# EAGLE design ble_blind_mover (EAGLE 9.6.2)
Assembly variants: USB_FALLBACK, 230V

## Sheet 1 of 4: Cover page
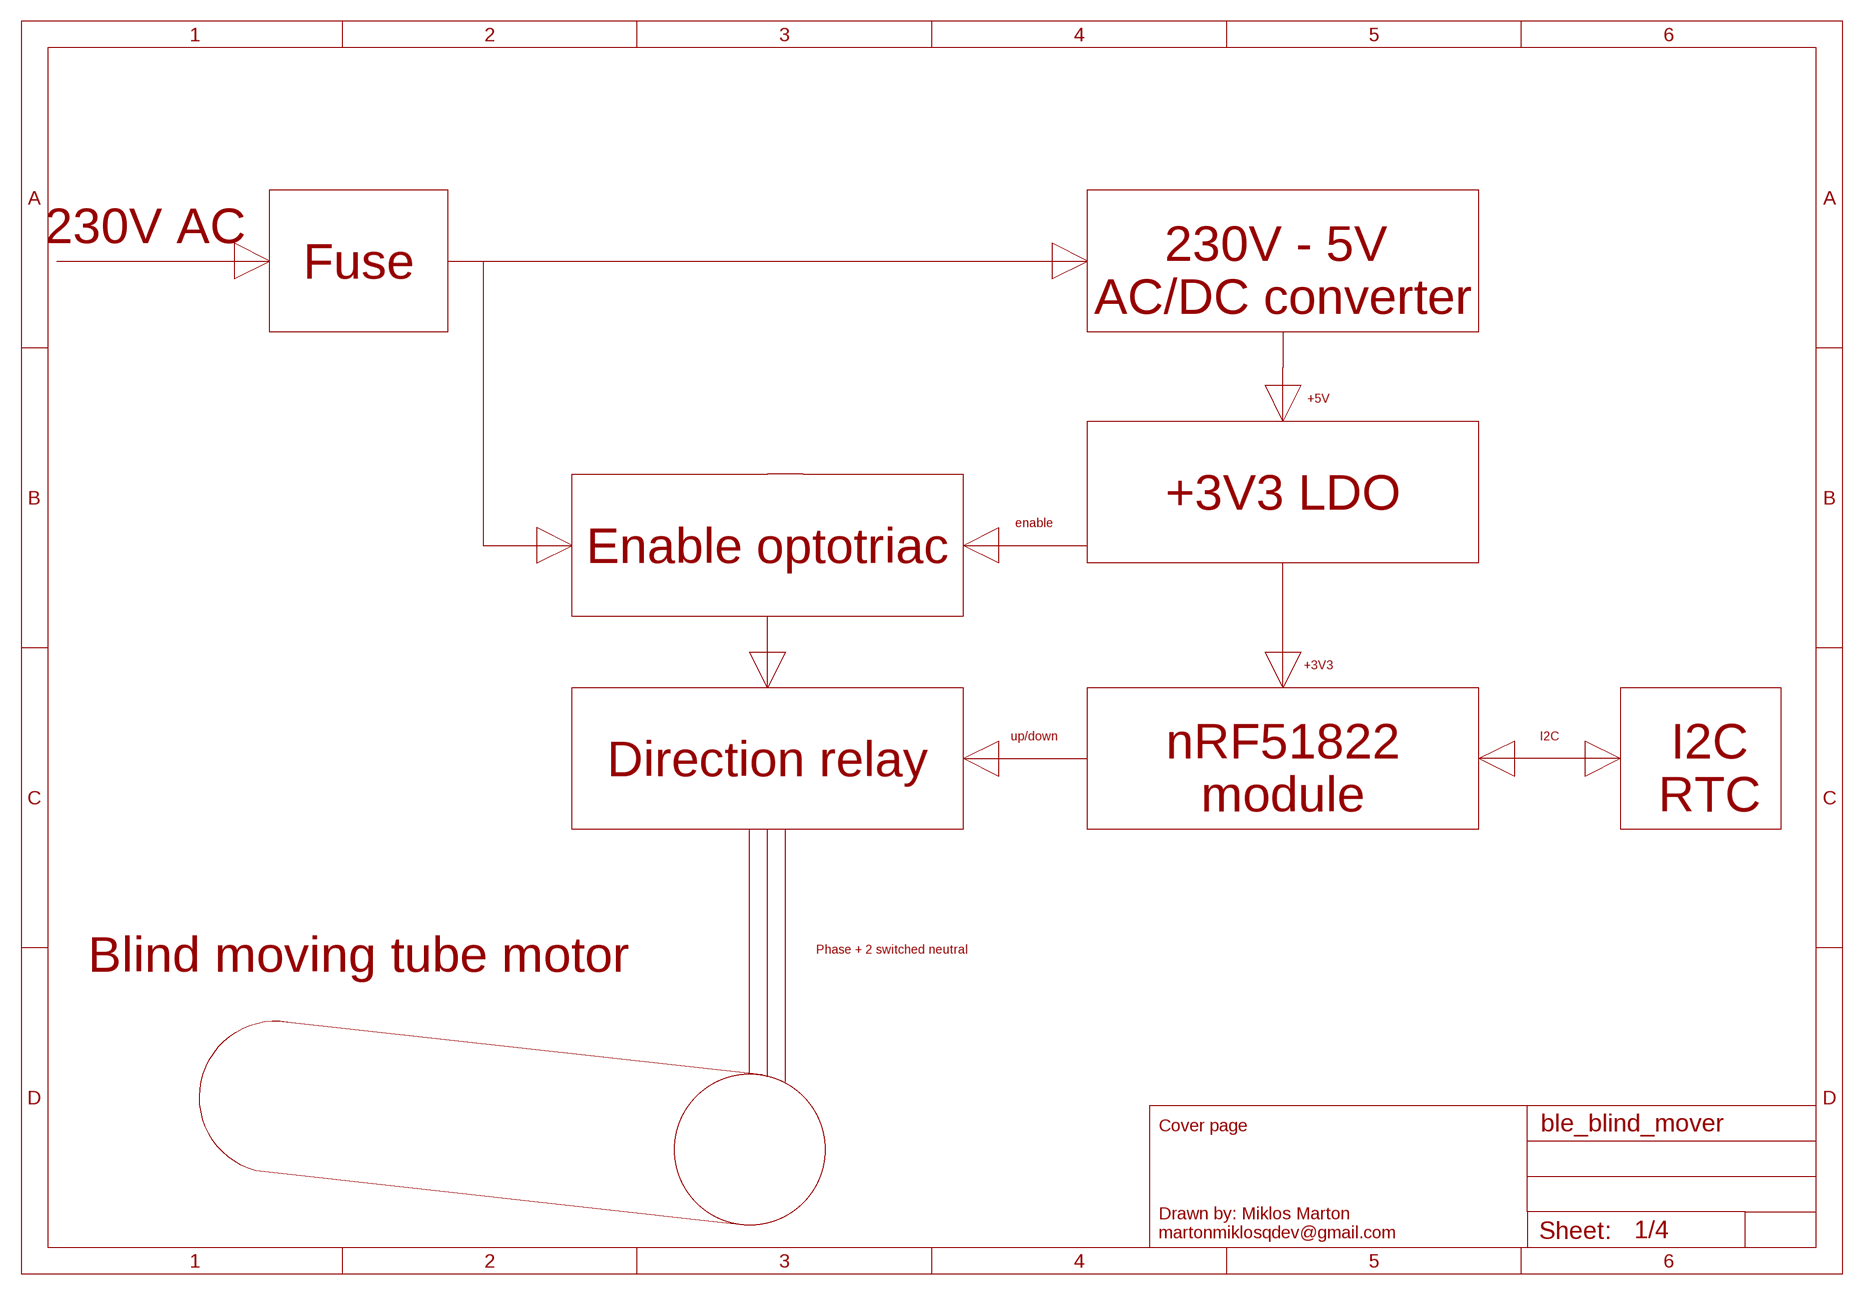
[diagram p0: schematic, sheet 1]

### Notes on the sheet
- 230V AC
- Fuse
- 230V - 5V 
  AC/DC converter
- +5V
- +3V3 LDO
- enable
- Enable optotriac
- +3V3
- up/down | I2C
- Direction relay
- nRF51822
  module
- I2C
  RTC
- Phase + 2 switched neutral
- Blind moving tube motor

## Sheet 2 of 4: High voltage parts (relays+ACDC converter)
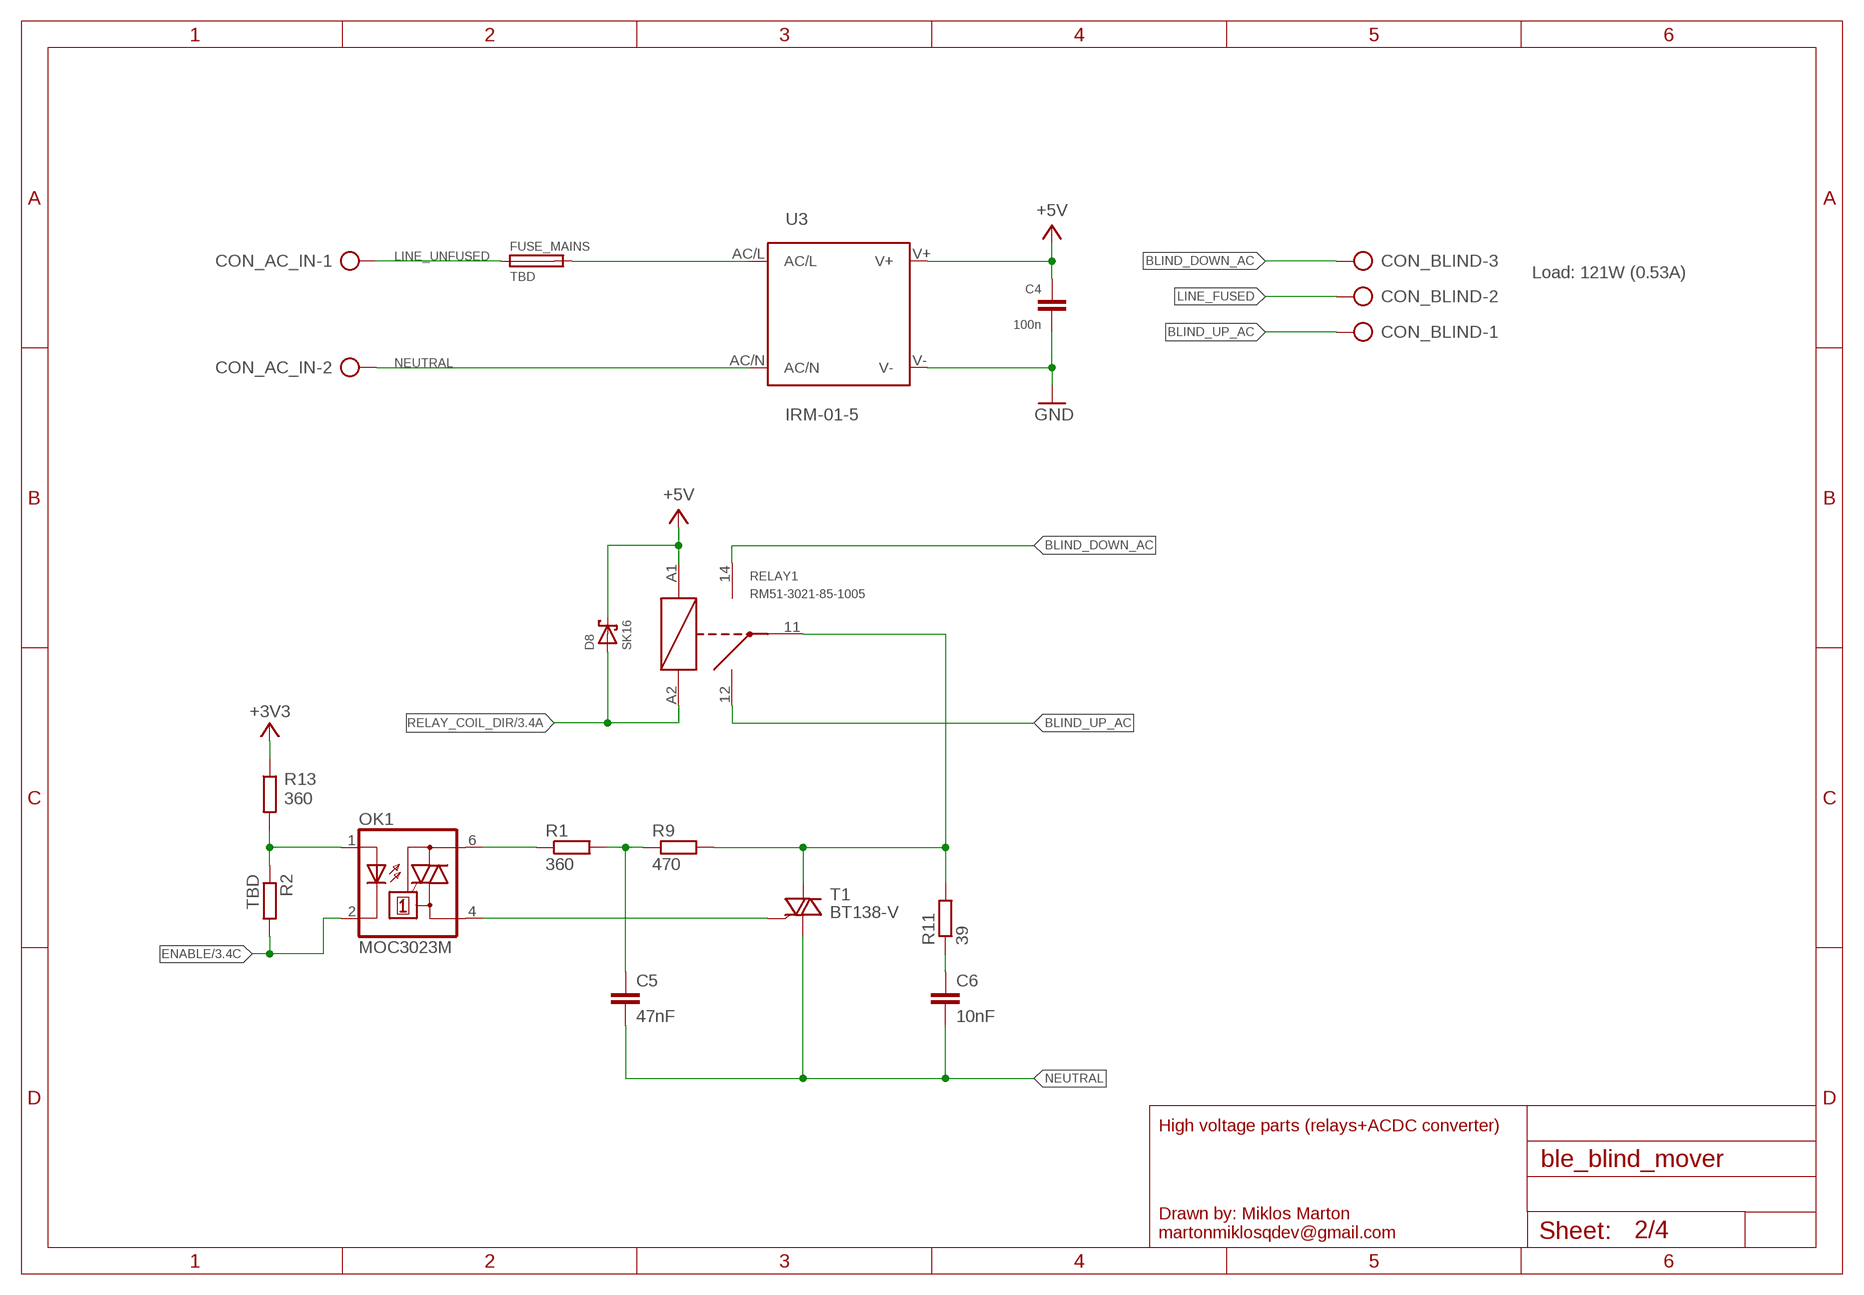
[diagram p1: schematic, sheet 2]

### Parts
C4  100n  C-EUC0603  [C0603]
C5  47nF  C-EU025-030X050  [C025-030X050]
C6  10nF  C-EU025-030X050  [C025-030X050]
CON_AC_IN  AK500/2  [AK500/2]
CON_BLIND  AK500/3  [AK500/3]
D8  SK16  SCHOTTKY-DIODESK12  [DO-214AC]
FUSE_MAINS  TBD  SH22,5  [SH22,5]
OK1  MOC3023M  [DIL06]
R1  360  R-EU_R0805  [R0805]
R2  TBD  R-EU_R0603  [R0603]
R9  470  R-EU_R0805  [R0805]
R11  39  R-EU_0204/2V  [0204V]
R13  360  R-EU_R0603  [R0603]
RELAY1  RM51-3021-85-1005  RM50-3011-XX-XXXX  [RM50-3011-XX-XXXX]
T1  BT138-V  [TO220BV]
U3  IRM-01-5  IRM_01/02IRM_01/02  [IRM_01/02]

### Nets
+3V3 [low_voltage]: R13.1 ; also sheet 3,4
+5V [low_voltage]: C4.1 D8.C RELAY1.A1 U3.V+ ; also sheet 3
BLIND_DOWN_AC [neutral]: CON_BLIND.3 RELAY1.14
BLIND_UP_AC [neutral]: CON_BLIND.1 RELAY1.12
ENABLE [low_voltage]: OK1.2(C) R2.2 ; also sheet 3
GND [low_voltage]: C4.2 U3.V- ; also sheet 3,4
LINE_FUSED [high_voltage]: CON_BLIND.2 FUSE_MAINS.2 U3.AC/L
LINE_UNFUSED [high_voltage]: CON_AC_IN.1 FUSE_MAINS.1
LOAD_B: R9.2 R11.2 RELAY1.11 T1.T2(A2)
MOC_AN: OK1.1(A) R2.1 R13.2
MOC_OUT: OK1.6(A2) R1.1
N$2: C5.1 R1.2 R9.1
NEUTRAL [high_voltage]: C5.2 C6.2 CON_AC_IN.2 T1.T1(A1) U3.AC/N
RELAY_COIL_DIR [low_voltage]: D8.A RELAY1.A2 ; also sheet 3
SNUB_MID: C6.1 R11.1
TRIAC_GET: OK1.4(A1) T1.G

### Notes on the sheet
- Load: 121W (0.53A)

## Sheet 3 of 4: BLE MCU
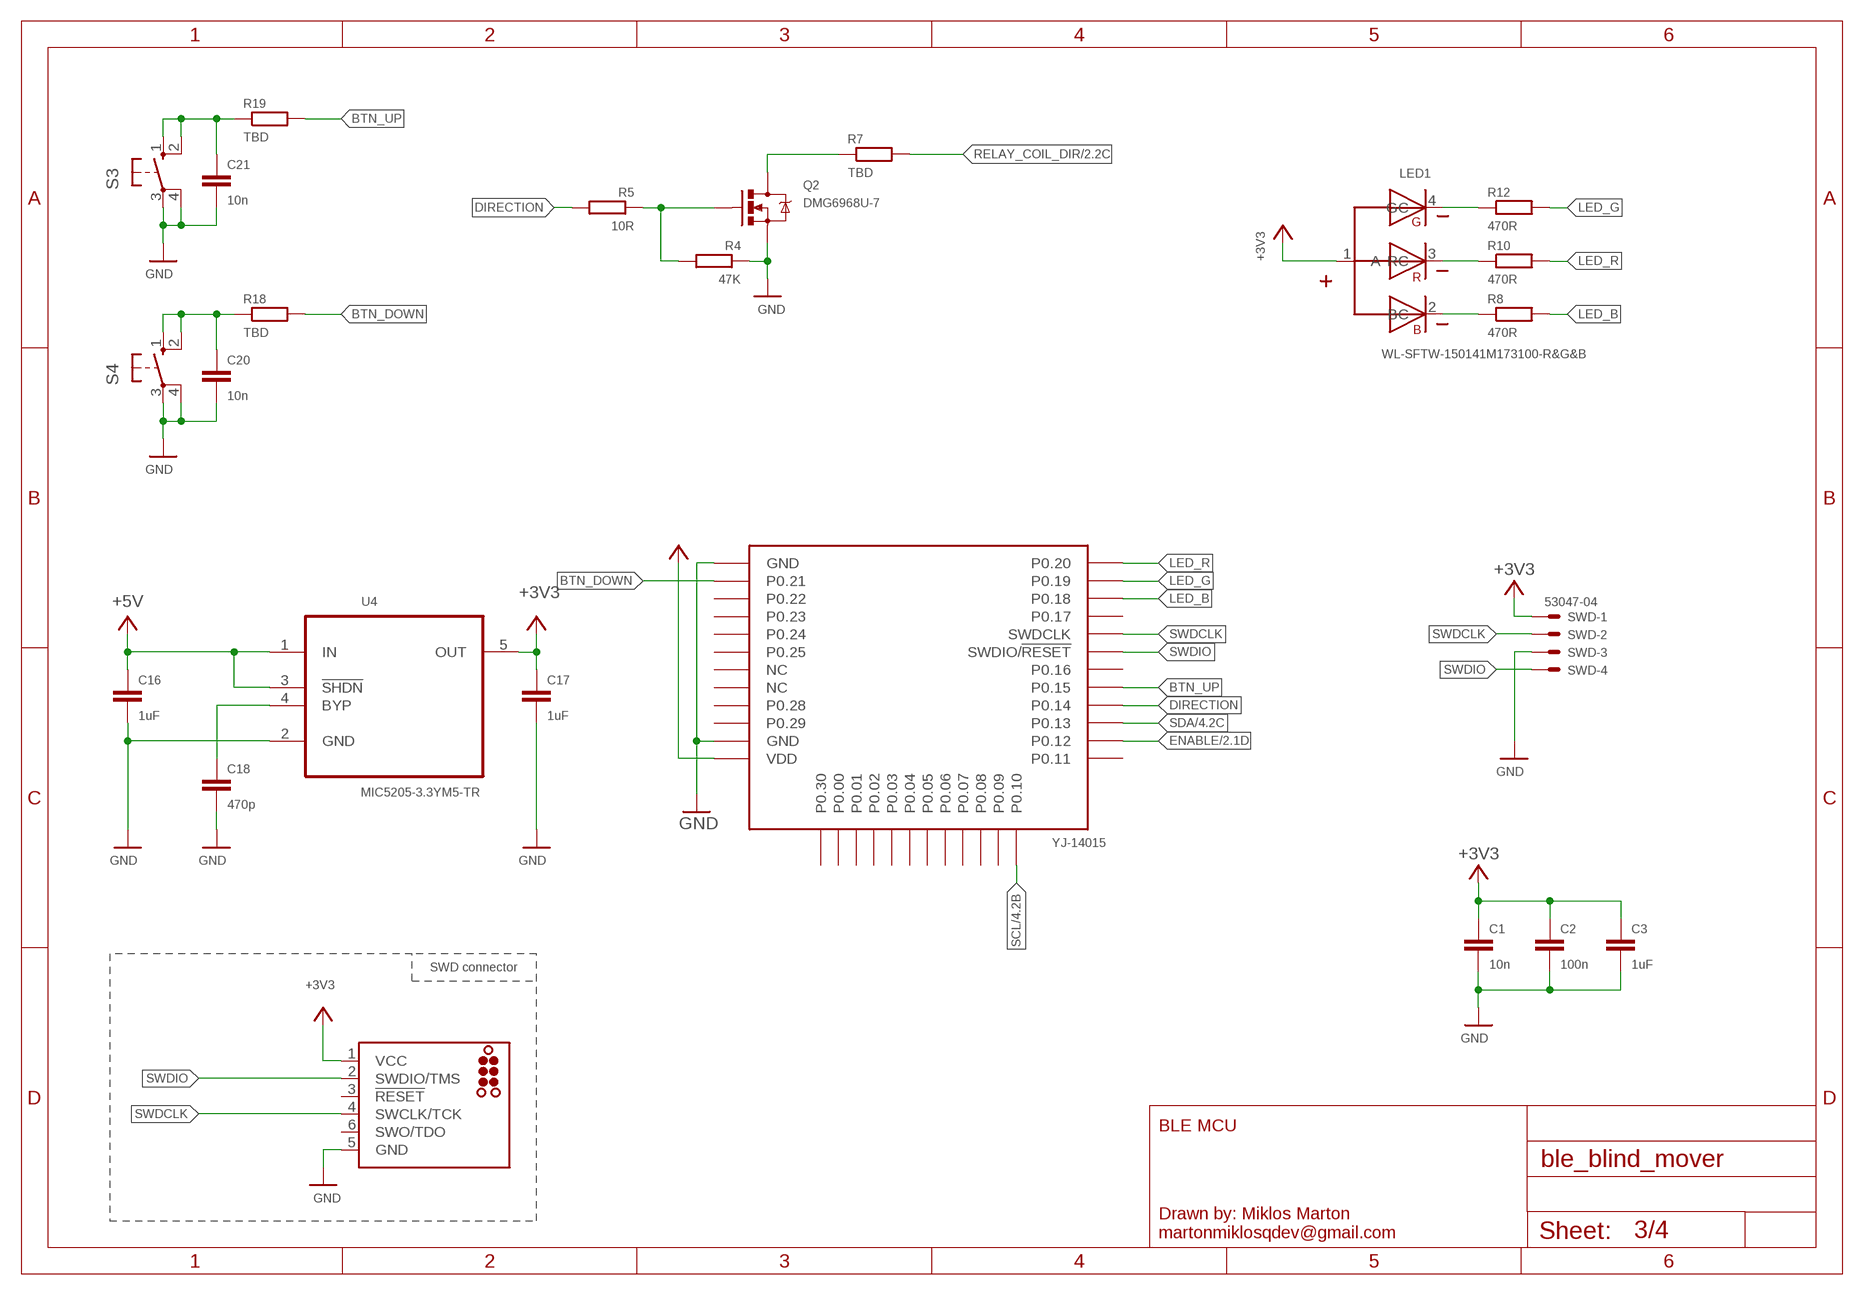
[diagram p2: schematic, sheet 3]

### Parts
C1  10n  C-EUC0603  [C0603]
C2  100n  C-EUC0603  [C0603]
C3  1uF  C-EUC0603  [C0603]
C16  1uF  C-EUC0603  [C0603]
C17  1uF  C-EUC0603  [C0603]
C18  470p  C-EUC0603  [C0603]
C20  10n  C-EUC0603  [C0603]
C21  10n  C-EUC0603  [C0603]
J2  TC2030_SWD-MCP-NL  [TC2030-MCP-NL]
LED1  WL-SFTW-150141M173100-R&G&B  [3528-COMMON-ANODE]
Q2  DMG6968U-7  MOSFET-NCHANNELSMD  [SOT23-3]
R4  47K  R-EU_R0603  [R0603]
R5  10R  R-EU_R0603  [R0603]
R7  TBD  R-EU_R0603  [R0603]
R8  470R  R-EU_R0603  [R0603]
R10  470R  R-EU_R0603  [R0603]
R12  470R  R-EU_R0603  [R0603]
R18  TBD  R-EU_R0603  [R0603]
R19  TBD  R-EU_R0603  [R0603]
S3  10-XX  [B3F-10XX]
S4  10-XX  [B3F-10XX]
SWD  53047-04  [53047-04]
U2  YJ-14015  [YJ-14015]
U4  MIC5205-3.3YM5-TR  LT1761ES5-3.3TRMPBF  [SOT95P280X145-5N]

### Nets
+3V3 [low_voltage]: C1.1 C2.1 C3.1 C17.1 J2.1(VCC) LED1.1(A) SWD.1 U2.VDD U4.5(OUT) ; also sheet 2,4
+5V [low_voltage]: C16.1 U4.1(IN) U4.3(!SHDN) ; also sheet 2
BTN_DOWN [low_voltage]: R18.2 U2.P.21(P0.21)
BTN_DOWN_R [low_voltage]: C20.1 R18.1 S4.1(S) S4.2(S1)
BTN_UP [low_voltage]: R19.2 U2.P.15(P0.15)
BTN_UP_R [low_voltage]: C21.1 R19.1 S3.1(S) S3.2(S1)
DIRECTION [low_voltage]: R5.2 U2.P.14(P0.14)
ENABLE [low_voltage]: U2.P.12(P0.12) ; also sheet 2
GND [low_voltage]: C1.2 C2.2 C3.2 C16.2 C17.2 C18.2 C20.2 C21.2 J2.5(GND) Q2.2(S) R4.1 S3.3(P) S3.4(P1) S4.3(P) S4.4(P1) SWD.3 U2.GND U2.GND@2(GND) U4.2(GND) ; also sheet 2,4
LED2_B_R [low_voltage]: LED1.2(BC) R8.1
LED2_G_R [low_voltage]: LED1.4(GC) R12.1
LED2_R_R [low_voltage]: LED1.3(RC) R10.1
LED_B [low_voltage]: R8.2 U2.P.18(P0.18)
LED_G [low_voltage]: R12.2 U2.P.19(P0.19)
LED_R [low_voltage]: R10.2 U2.P.20(P0.20)
MOTOR_B_GATE_R [low_voltage]: Q2.1(G) R4.2 R5.1
RELAY_COIL_DIR [low_voltage]: R7.2 ; also sheet 2
RELAY_COIL_DIR_R [low_voltage]: Q2.3(D) R7.1
SCL: U2.P.10(P0.10) ; also sheet 4
SDA [low_voltage]: U2.P.13(P0.13) ; also sheet 4
SWDCLK [low_voltage]: J2.4(SWCLK/TCK) SWD.2 U2.SWDCLK
SWDIO [low_voltage]: J2.2(SWDIO/TMS) SWD.4 U2.SWDIO(SWDIO/!RESET)
U4_BYPASS [low_voltage]: C18.1 U4.4(BYP)
Unconnected: J2.3(!RESET) J2.6(SWO/TDO) U2.P.00(P0.00) U2.P.01(P0.01) U2.P.02(P0.02) U2.P.03(P0.03) U2.P.04(P0.04) U2.P.05(P0.05) U2.P.06(P0.06) U2.P.07(P0.07) U2.P.08(P0.08) U2.P.09(P0.09) U2.P.11(P0.11) U2.P.16(P0.16) U2.P.17(P0.17) U2.P.22(P0.22) U2.P.23(P0.23) U2.P.24(P0.24) U2.P.25(P0.25) U2.P.26(NC) U2.P.27(NC) U2.P.28(P0.28) U2.P.29(P0.29) U2.P.30(P0.30)

### Notes on the sheet
- SWD connector

## Sheet 4 of 4: I2C RTC
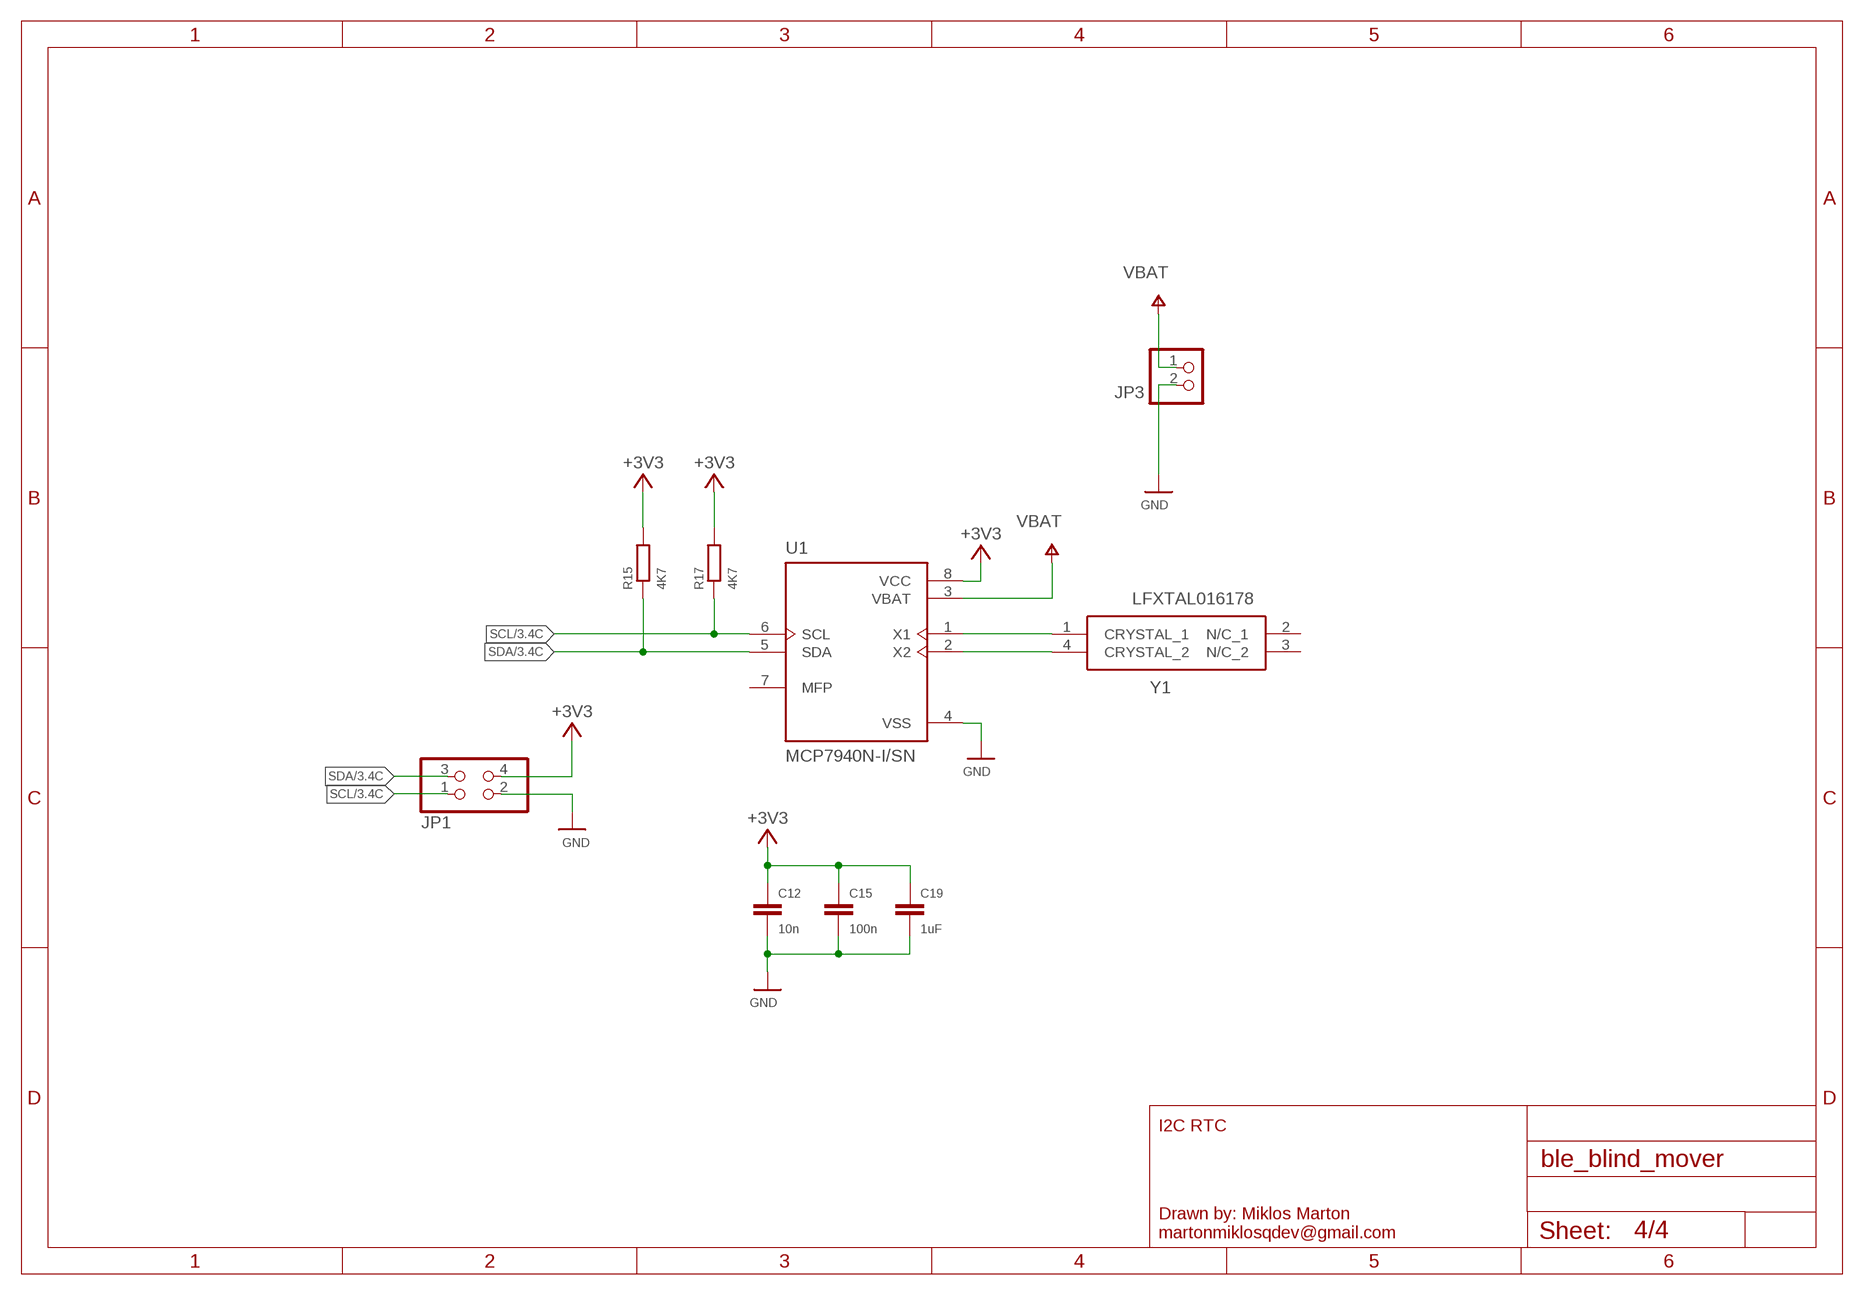
[diagram p3: schematic, sheet 4]

### Parts
C12  10n  C-EUC0603  [C0603]
C15  100n  C-EUC0603  [C0603]
C19  1uF  C-EUC0603  [C0603]
JP1  PINHD-2X2  [2X02]
JP3  PINHD-1X2  [1X02]
R15  4K7  R-EU_R0603  [R0603]
R17  4K7  R-EU_R0603  [R0603]
U1  MCP7940N-I/SN  [SOIC127P600X175-8N]
Y1  LFXTAL016178  [LFXTAL016178_1]

### Nets
+3V3 [low_voltage]: C12.1 C15.1 C19.1 JP1.4 R15.2 R17.2 U1.8(VCC) ; also sheet 2,3
GND [low_voltage]: C12.2 C15.2 C19.2 JP1.2 JP3.2 U1.4(VSS) ; also sheet 2,3
RTC_XTAL1: U1.1(X1) Y1.1(CRYSTAL_1)
RTC_XTAL2: U1.2(X2) Y1.4(CRYSTAL_2)
SCL: JP1.1 R17.1 U1.6(SCL) ; also sheet 3
SDA [low_voltage]: JP1.3 R15.1 U1.5(SDA) ; also sheet 3
VBAT: JP3.1 U1.3(VBAT)
Unconnected: U1.7(MFP) Y1.2(N/C_1) Y1.3(N/C_2)

## Library data of the parts
C1-C6 C12 C15-C21 = rcl:C-EU: CAPACITOR, European symbol
CON_AC_IN = con-ptr500:AK500/2: CONNECTOR; OC_FARNELL: unknown; OC_NEWARK: unknown
CON_BLIND = con-ptr500:AK500/3: CONNECTOR; OC_FARNELL: unknown; OC_NEWARK: unknown
D8 = diode:SCHOTTKY-DIODE: Schottky Diode; OC_RET: 95-01-34
FUSE_MAINS = fuse:SH22,5: FUSE HOLDER grid 22,5 mm, OGN0031 8201, Schurter (Buerklin); MF: SCHURTER; MPN: 0031.8201; OC_RET: 51-01-42
J2 = tag-connect:TC2030_SWD: ARM20-CTX 20-Pin to TC2030-IDC Adapter for Cortex 6-Pin (TC2030-IDC family) </catalog/6> Cortex SWD </catalog/9> Adapters </adaptors> <javascript:void(0);> The Tag-Connect ARM20-CTX adapter board allows our TC2030-IDC cables to be used for ARM SWD (Single Wire Debug) applications. Although intended for use with our patented TC2030-IDC (and TC2030-IDC-NL) Plug-of-Nails™ Cables, the adapter may be useful to people wishing to use 6-pin 0.1” ribbon headers on their PCB instead of the traditional 20-Pin header. Please note the TC2030-IDC <http://tag-connect.com/TC2030-IDC> or TC2030-IDC-NL <http://tag-connect.com/TC2030-IDC-NL> cable is purchased separately, the cables and Segger JLINK seen in the pictures are not included! Download the Datasheet here. <http://www.tag-connect.com/Materials/ARM20-CTX.pdf>
JP1 = pinhead:PINHD-2X2: PIN HEADER
JP3 = pinhead:PINHD-1X2: PIN HEADER
LED1 = Wurth_Elektronik_Optoelectronics_rev15b:WL-SFTW: SMD full-color TOP LED Characteristics Low energy consumption High reliability Low current requirement Fast switching No UV/IR radiation High brightness RGB individual control Compact package outline Black surface Applications Flash light Switch indicators Equipments indicators Accent and decorative lighting Electronic signage Video displays Backlight for LCDs, PDAs and TVs Oven, microwave Street lighting Ideal for lateral coupling in light guides <http://katalog.we-online.de/media/images/eipal/WL-SFTW_pf2.jpg> Details see: http://katalog.we-online.de/en/led/WL-SFTW?m Updated 2015-04-10 2015 (C) Wurth Elektronik
OK1 = optocoupler:MOC30*M: RANDOM-PHASE OPTOISOLATORS TRIAC DRIVER OUTPUT Source: http://www.fairchildsemi.com MOC3020-M.pdf; MF: FAIRCHILD SEMICONDUCTOR; MPN: MOC3023-M; OC_FARNELL: 1021367; OC_NEWARK: 72K8896
Q2 = SparkFun:MOSFET-NCHANNEL
R1 R2 R4 R5 R7 R9 R11 R13 R15 R17-R19 = rcl:R-EU_: RESISTOR, European symbol
R8 R10 R12 = rcl:R-EU_: RESISTOR, European symbol; OC_TME: SMD0603-470R
RELAY1 = relay-relpol:RM50-3011-XX-XXXX: RM50-3011-XX-XXXX (1CO) miniature relays from relpol S.A. <http://www.relpol.pl> (C) 2014 Tomasz Boleslaw CEDRO, cederom@tlen.pl, http://www.tomek.cedro.info. Version 0.1 (2014-01-12): Initial release.; OC_TME: RM513021851005
S3 S4 = switch-omron:10-XX: OMRON SWITCH; MPN: B3F-1000; OC_FARNELL: 176432; OC_NEWARK: 36M3542
SWD = con-molex:53?-04: CONNECTOR wire to board 1.25 mm (.049 inch) pitch header; MF: WALDOM/MOLEX; MPN: 53047-0410; OC_FARNELL: 9733060; OC_NEWARK: 38C9900
T1 = triac:BT138: TRIAC Source: http://www.semiconductors.philips.com BT138_SERIES_2.pdf
U1 = MCP7940N-I_SN:MCP7940N-I/SN: Real Time Clock (RTC) IC Clock/Calendar 64B I²C, 2-Wire Serial 8-SOIC (0.154", 3.90mm Width); AVAILABILITY: Unavailable; DESCRIPTION: Real Time Clock _RTC_ IC Clock/Calendar 64B I²C, 2-Wire Serial 8-SOIC _0.154, 3.90mm Width_; MF: Microchip; MP: MCP7940N-I/SN; OC_TME: MCP7940N-I/SN; PACKAGE: SO-8 Microchip; PRICE: None
U2 = YJ-14015:YJ-14015
U3 = meanwell_irm_v7:IRM_01/02: 1 or 2 watt housing & pin compatible IRM 01 Vout [V] Imax [A] Pmax [W] Eff [%] 3.3 0.3 1 66 5 0.2 1 70 9 0.111 1 72 12 0.083 1 74 15 0.067 1 75 24 0.042 1 77 IRM 2 Vout [V] Imax [A] Pmax [W] Eff [%] 3.3 0.6 2 66 5 0.4 2 70 9 0.222 2 72 12 0.167 2 74 15 0.133 2 75 24 0.087 2 77; OC_TME: IRM-01-5
U4 = LTC_By_element14_Batch_1:LT1761ES5-3.3TRMPBF: 100mA, Low Noise, LDO Micropower Regulators; MPN: LT1761ES5-3.3#TRMPBF; OC_FARNELL: 1663779; OC_NEWARK: 19P0920; OC_TME: MIC5205-3.3YM5-TR; PACKAGE: SOT-23-5; SUPPLIER: Linear Technology
Y1 = LFXTAL016178:LFXTAL016178: IQD FREQUENCY PRODUCTS - LFXTAL016178 - CRYSTAL, 32.768KHZ, 6PF, SMD Source: Datasheet <http://www.iqdfrequencyproducts.com/products/pn/LFXTAL016178Bulk.pdf>; DESCRIPTION: IQD FREQUENCY PRODUCTS - LFXTAL016178 - CRYSTAL, 32.768KHZ, 6PF, SMD; HEIGHT: mm; MANUFACTURER_NAME: IQD; MANUFACTURER_PART_NUMBER: LFXTAL016178; OC_TME: 32.768K-85SMXR; RS_PART_NUMBER: 1484350; RS_PRICE-STOCK: https://uk.rs-online.com/web/p/products/1484350

## Net classes
1 power: drill 0.5 mm
4 low_voltage: clearance 3 mm to class 3
6 neutral: clearance 3 mm to class 5

## Board
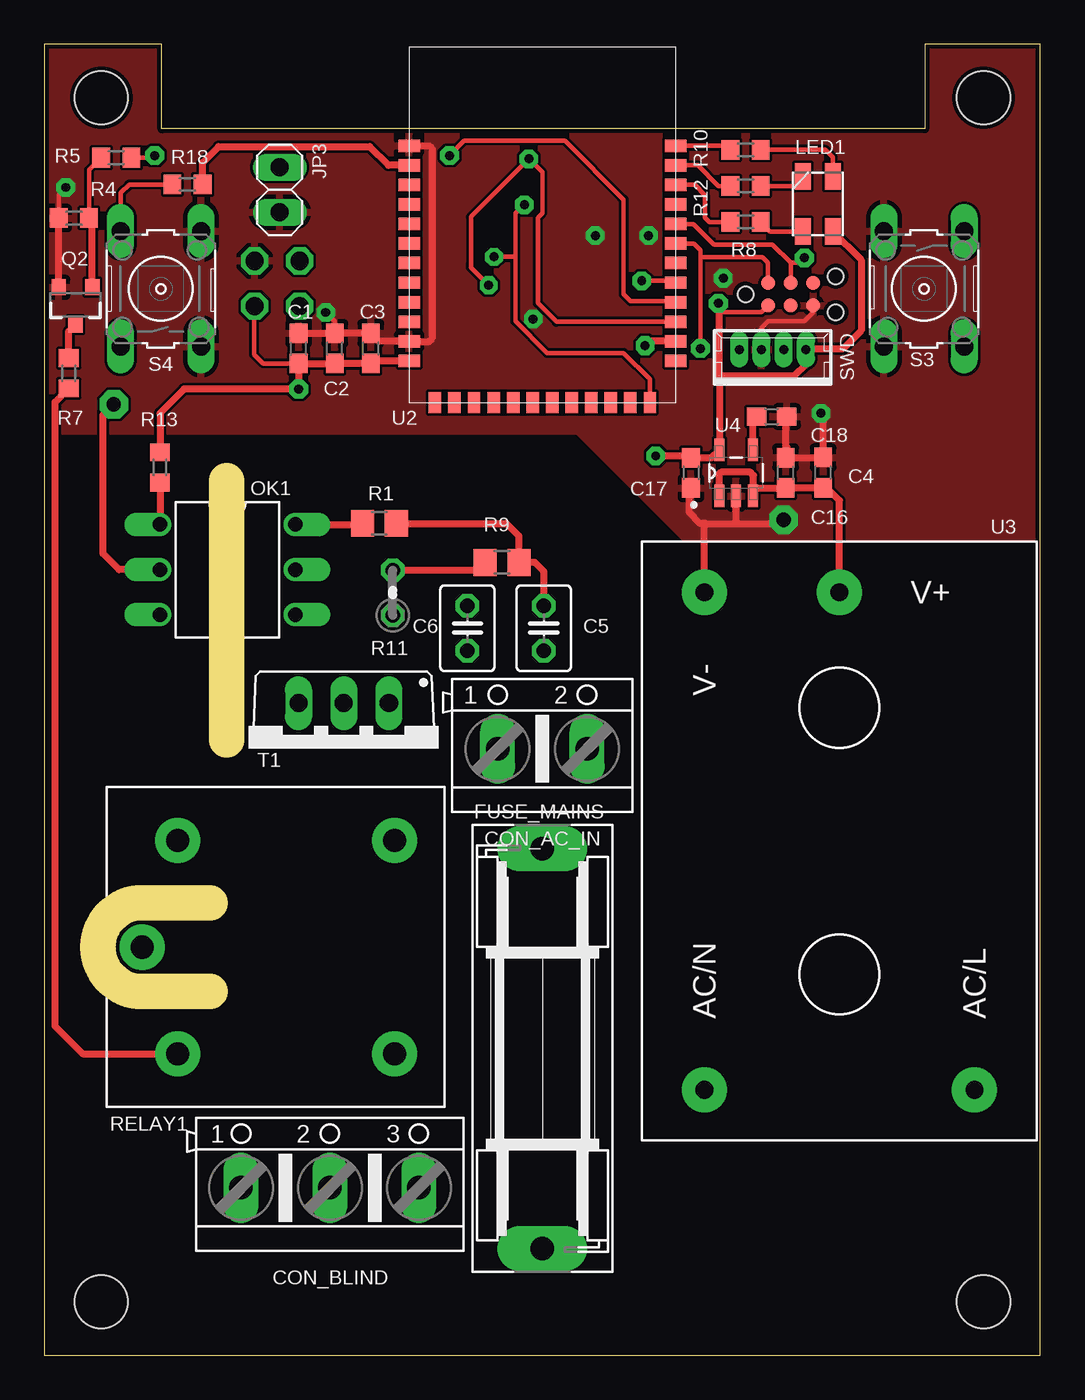
[diagram p4: board, top side]
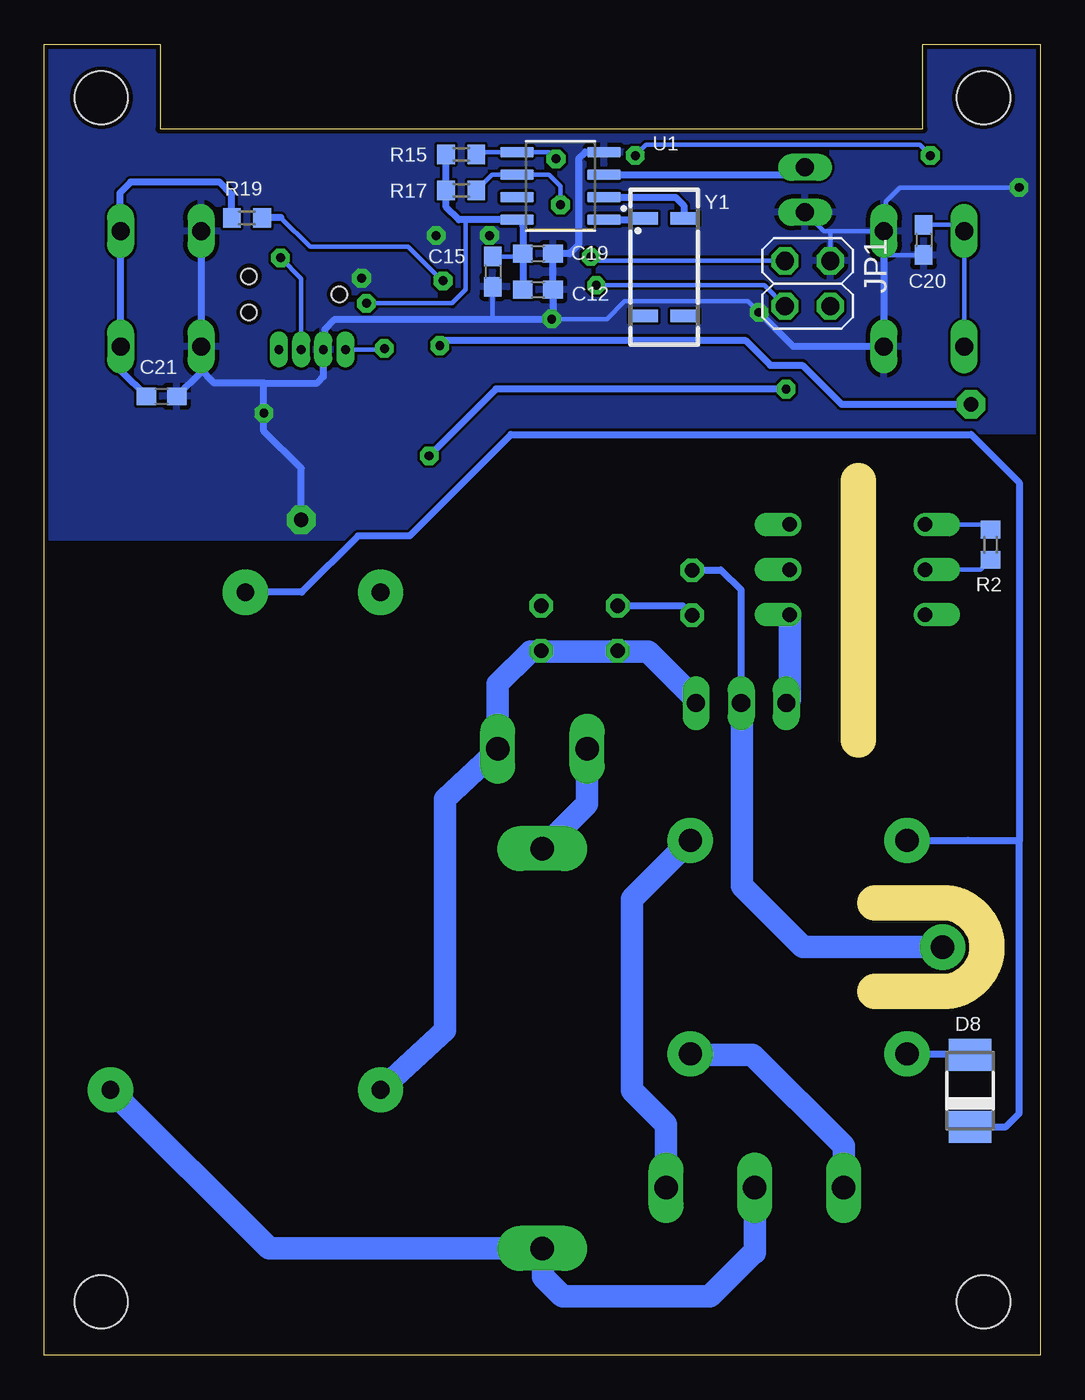
[diagram p5: board, bottom side, seen from below]

Size 56.05 x 73.75 mm. Coordinates in mm from the lower left corner, seen from the top.
Outline: 9.32,25.45 5.51,25.45 arc180 5.51,20.45 9.32,20.45
Outline: 10.25,34.61 10.25,49.22
Outline: 0,73.75 0,0 56.05,0 56.05,73.75 49.55,73.75 49.55,69 6.61,69 6.61,73.75 0,73.75
Copper layers (1*16): Top 0.035mm / dielectric 1.5mm / Bottom 0.035mm
Design rules "dirt_cheap_dirty_boards.v1": minimum track width 5mil, minimum drill 0.3mm, track to track 6mil, track to pad 6mil, pad to pad 6mil, via to via 6mil, smd to smd 0mil, copper to edge 10mil, drill to drill 10mil, minimum pad ring 10mil, minimum via ring 6mil, stop-mask expansion 2mil, vias tented up to drill 25mil, thermal gap 10mil
Holes 3 mm at 52.85,3 3.2,3 3.2,70.75 52.85,70.75

### Footprints (pad centres in the part's own frame; a part is rotated, then mirrored left to right if it is on the bottom)
C0603 = smd 1.1 x 1: 1 -0.85,0; 2 0.85,0
C025-030X050 = drill 0.813 octagon: 1 -1.27,0; 2 1.27,0
AK500/2 = drill 1.321 long: 1 -2.515,0; 2 2.515,0
AK500/3 = drill 1.321 long: 1 -5.004,0; 2 0,0; 3 5.004,0
DO-214AC = smd 1.8 x 2.4: A 2.025,0; C -2.025,0
SH22,5 = drill 1.321 pad 2.54 long: 1 -11.252,0; 2 11.252,0
TC2030-MCP-NL = smd 0.787 x 0.787: 1 1.27,-0.635; 2 1.27,0.635; 3 2.54,-0.635; 4 2.54,0.635; 5 3.81,-0.635; 6 3.81,0.635 | hole 0.889: 0,0; 5.08,-1.016; 5.08,1.016
2X02 = drill 1.016 octagon: 1 -1.27,-1.27; 2 -1.27,1.27; 3 1.27,-1.27; 4 1.27,1.27
1X02 = drill 1.016 long: 1 -1.27,0; 2 1.27,0
3528-COMMON-ANODE = smd 1.5 x 0.9: 1 1.55,0.85; 2 1.55,-0.85; 3 -1.55,0.85; 4 -1.55,-0.85
DIL06 = drill 0.813 offset: 1 -2.54,-3.81; 2 0,-3.81; 3 2.54,-3.81; 4 2.54,3.81; 5 0,3.81; 6 -2.54,3.81
SOT23-3 = smd 0.8 x 0.9: 1 -0.95,-1; 2 0.95,-1; 3 0,1.1
R0805 = smd 1.3 x 1.5: 1 -0.95,0; 2 0.95,0
R0603 = smd 1 x 1.1: 1 -0.85,0; 2 0.85,0
0204V = drill 0.813 octagon: 1 -1.27,0; 2 1.27,0
RM50-3011-XX-XXXX = drill 1.3 pad 2.54: 11 0,0; 12 14.2,-6; 14 14.2,6; A1 2,6; A2 2,-6
B3F-10XX = drill 1.016 long: 1 -3.251,2.261; 2 3.251,2.261; 3 -3.251,-2.261; 4 3.251,-2.261
53047-04 = drill 0.5 pad 0.698 long: 1 1.875,0.45; 2 0.625,0.45; 3 -0.625,0.45; 4 -1.875,0.45
TO220BV = drill 1.016 long: G 2.54,-2.54; T1 -2.54,-2.54; T2 0,-2.54
SOIC127P600X175-8N = smd 1.9 x 0.6: 1 -2.455,1.905; 2 -2.455,0.635; 3 -2.455,-0.635; 4 -2.455,-1.905; 5 2.455,-1.905; 6 2.455,-0.635; 7 2.455,0.635; 8 2.455,1.905
YJ-14015 = smd 1.2 x 0.7: GND -7.5,3.45; GND@2 -7.5,14.45; P.11 7.5,2.35; P.12 7.5,3.45; P.13 7.5,4.55; P.14 7.5,5.65; P.15 7.5,6.75; P.16 7.5,7.85; P.17 7.5,11.15; P.18 7.5,12.25; P.19 7.5,13.35; P.20 7.5,14.45; P.21 -7.5,13.35; P.22 -7.5,12.25; P.23 -7.5,11.15; P.24 -7.5,10.05; P.25 -7.5,8.95; P.26 -7.5,7.85; P.27 -7.5,6.75; P.28 -7.5,5.65; P.29 -7.5,4.55; SWDCLK 7.5,10.05; SWDIO 7.5,8.95; VDD -7.5,2.35 | smd 0.7 x 1.2: P.00 -4.95,0; P.01 -3.85,0; P.02 -2.75,0; P.03 -1.65,0; P.04 -0.55,0; P.05 0.55,0; P.06 1.65,0; P.07 2.75,0; P.08 3.85,0; P.09 4.95,0; P.10 6.05,0; P.30 -6.05,0
IRM_01/02 = drill 1 pad 2.54: AC/L -14,-7.6; AC/N -14,7.6; V+ 14,0; V- 14,7.6
SOT95P280X145-5N = smd 1.27 x 0.559: 1 -1.295,0.94; 2 -1.295,0; 3 -1.295,-0.94; 4 1.295,-0.94; 5 1.295,0.94
LFXTAL016178_1 = smd 0.7 x 1.6: 1 -2.75,-1.15; 2 2.75,-1.15; 3 2.75,1.15; 4 -2.75,1.15

### Placement (x,y rotation side)
C1  14.31,56.64 90 top
C2  16.34,56.64 90 top
C3  18.37,56.64 90 top
C4  43.83,49.66 90 top
C5  28.1,40.9 270 top
C6  23.8,40.9 270 top
C12  28.28,59.94 0 bottom
C15  30.82,60.96 270 bottom
C16  41.72,49.64 90 top
C17  36.38,49.64 270 top
C18  40.92,52.81 0 top
C19  28.28,61.98 0 bottom
C20  6.57,62.75 270 bottom
C21  49.45,53.95 0 bottom
CON_AC_IN  28.02,34.11 0 top
CON_BLIND  16.07,9.41 0 top
D8  3.96,14.88 90 bottom
FUSE_MAINS  28.02,17.25 270 top
J2  39.45,59.69 0 top
JP1  13.1,60.3 270 bottom
JP3  13.24,65.57 270 top
LED1  43.52,64.77 270 top
OK1  10.3,44.2 270 top
Q2  1.75,59.08 180 top
R1  18.85,46.8 0 top
R2  2.8,45.6 270 bottom
R4  1.66,63.98 0 top
R5  4.04,67.38 0 top
R7  1.37,55.25 270 top
R8  39.45,63.75 180 top
R9  25.75,44.6 180 top
R10  39.45,67.82 180 top
R11  19.6,42.9 90 top
R12  39.45,65.79 180 top
R13  6.5,49.95 270 top
R15  32.6,67.56 180 bottom
R17  32.6,65.53 180 bottom
R18  8.05,65.87 0 top
R19  44.65,63.99 0 bottom
RELAY1  5.51,22.95 0 top
S3  49.5,60 270 top
S4  6.55,60 90 top
SWD  40.98,56.13 0 top
T1  16.84,34.14 180 top
U1  27.01,65.79 180 bottom
U2  28.02,53.59 0 top
U3  44.74,28.92 90 top
U4  38.92,49.64 90 top
Y1  21.17,61.21 270 bottom

### Tracks (layer width: path | path; a pad name or v marks a point on that pad's centre or on a via)
+3V3  (via drill 0.5 pad 1.05)
  Top 0.254: 18.52,55.94 C3.1 | SWD.1 42.91,56.64 | 37.93,55.88 37.93,58.67 | v37.93,59.18 37.93,58.67 | J2.1 40.34,58.67 37.93,58.67 | C1.1 12.31,55.79 11.8,56.3 11.8,59 JP1.4
  Top 0.406: 18.52,55.94 U2.VDD | C3.1 C2.1 C1.1 v14.31,54.36 7.86,54.36 6.5,53 R13.1 | LED1.1 45.96,61.63 45.96,57.66 44.95,56.64 42.91,56.64 42.9,56.63 42.9,55.8 42.22,55.12 38,55.12 37.98,55.1 | 37.98,55.1 U4.5 37.54,50.49 C17.1 36.1,50.77 35.93,50.6 v34.4,50.6 | 37.98,55.1 37.98,59.13 v37.93,59.18
  Bottom 0.254: U1.8 29.13,63.55 | C15.1 29.3,61.81 C19.1 | 32.34,63.88 32.34,59.94 33.1,59.18 v37.93,59.18
  Bottom 0.406: R15.2 R17.2 33.45,64.6 32.72,63.88 32.34,63.88 U1.8 | C12.1 C19.1 29.13,63.55 | v14.31,54.36 30.64,54.36 v34.4,50.6
+5V
  Top 0.406: U4.1 37.98,49.58 38.1,49.7 39.7,49.7 39.9,49.5 39.9,48.7 | 39.9,48.7 39.9,48.38 U4.3 | 39.9,48.7 39.99,48.79 C16.1 44.04,48.79 | U3.V+ 44.74,48.09 44.04,48.79 | C4.1 44.02,48.81 44.04,48.79
  Bottom 0.406: D8.C 1.95,12.85 1.2,13.6 1.2,28.9 | RELAY1.A1 4.1,28.95 | 4.08,28.97 4.1,28.95 | 1.2,28.9 1.25,28.95 4.1,28.95 | U3.V+ 41.58,42.92 38.4,46.1 35.5,46.1 29.8,51.8 3.9,51.8 1.2,49.1 1.2,28.9
BLIND_DOWN_AC
  Bottom 1.27: CON_BLIND.3 21.07,12.97 23,14.9 23,25.66 RELAY1.14
BLIND_UP_AC
  Bottom 1.27: RELAY1.12 19.65,16.9 16.2,16.9 11.06,11.76 CON_BLIND.1
BTN_DOWN
  Top 0.406: U2.P.21 19.36,66.94 18.3,68 9.8,68 8.9,67.1 R18.2
BTN_DOWN_R
  Top 0.254: R18.1 4.77,65.87 4.3,65.4 4.3,63.26 S4.2
  Bottom 0.254: S4.1 S4.2 4.64,63.6 C20.1
BTN_UP  (via drill 0.5 pad 1.05)
  Top 0.254: v33.61,60.45 35.42,60.45 U2.P.15
  Bottom 0.254: 42.76,64.01 41.11,62.36 35.59,62.36 33.68,60.45 v33.61,60.45
  Bottom 0.406: 42.76,64.01 43.78,64.01 R19.2
BTN_UP_R
  Bottom 0.406: R19.1 45.5,65.3 46.2,66 51.2,66 51.8,65.4 51.8,63.29 | 51.8,63.29 S3.1 | C21.1 51.76,55.41 S3.2 S3.1 | S3.1 51.8,63.29
DIRECTION  (via drill 0.5 pad 1.05)
  Top 0.254: U2.P.14 35.47,59.3 32.98,59.3 32.6,59.69 32.6,65.02 29.3,68.33 23.63,68.33 v22.8,67.5 | R5.2 6.08,67.38 v6.2,67.5
  Bottom 0.254: v22.8,67.5 22.2,68.1 6.8,68.1 v6.2,67.5
ENABLE  (via drill 0.5 pad 1.05, 0.8 pad 1.6)
  Top 0.406: U2.P.12 34.04,57.04 v33.8,56.8 | OK1.2 4.2,44.2 3.3,45.1 3.3,52.9 v3.9,53.5
  Bottom 0.254: OK1.2 3.35,44.2 R2.2
  Bottom 0.406: v33.8,56.8 33.49,57.11 16.61,57.11 15.2,55.7 13.4,55.7 11.2,53.5 v3.9,53.5
GND  (via drill 0.5 pad 1.05, 0.8 pad 1.6)
  Top 0.254: U2.GND 20.15,57.04 | 16.09,57.49 C2.2 16.34,58.17 v15.83,58.67 | SWD.3 40.35,57.8 40.73,58.17 42.76,58.17 43.27,58.67 J2.5 | R4.1 0.81,65.31 v1.2,65.7
  Top 0.406: 20.15,57.04 18.82,57.04 C3.2 C2.2 | C1.2 16.09,57.49 | 36.32,48.23 C17.2 36.3,48.71 36.3,47.4 36.9,46.8 37.2,46.8 | 41.72,51 C16.2 43.81,50.49 C4.2 43.83,52.87 v43.7,53 | 41.72,51 41.72,52.75 C18.2 | 41.79,51.07 41.72,51 | 38.92,47.42 U4.2 38.92,46.98 38.9,46.8 | 38.9,46.8 41.4,46.8 v41.6,47 | 37.2,46.8 38.9,46.8 | 37.2,46.8 37.14,46.74 U3.V- | Q2.2 0.8,62.17 R4.1 | U2.GND@2 21.66,68.04 21.8,67.9 21.8,57.2 21.6,57 20.57,57 U2.GND
  Bottom 0.203: 27.43,60.2 C12.2
  Bottom 0.254: SWD.3 40.35,57.09 40.27,57.18 | C15.2 30.82,58.28 | 25.61,67.69 U1.4 | v1.2,65.7 7.9,65.7 8.7,64.9 8.7,63.36 S4.4 11.8,63.25 | 11.8,63.25 11.9,63.25 11.83,63.18 JP1.2 | C20.2 8.81,61.9 | v27.5,58.3 24.4,58.3 23.4,59.3 16.46,59.3 v15.83,58.67 | JP3.2 12.19,63.25 11.8,63.25
  Bottom 0.406: 40.27,57.18 40.27,57.72 39.71,58.28 30.82,58.28 27.43,58.28 C12.2 | 27.43,60.2 C19.2 26.5,61.98 25.99,62.48 25.99,67.31 25.61,67.69 | v41.6,47 41.6,49.9 43.7,52 v43.7,53 43.7,54.7 | SWD.3 40.35,55.05 40.7,54.7 43.7,54.7 | 43.7,54.7 46.5,54.7 47.3,55.5 47.3,56.69 S3.4 | 8.9,56.75 S4.3 | 8.9,56.75 13.91,56.75 v15.83,58.67 | S4.4 8.81,61.9 8.81,56.84 8.9,56.75 | S3.4 47.24,55.31 C21.2 | S3.3 S3.4
  other vias: 34,63 31,63 38.2,60.6
  pour Top: 0,73.75 0,52 30,52 36,46 56.05,46 56.05,73.75 49.55,73.75 49.55,69 6.61,69 6.61,73.75
  pour Bottom: 0,73.75 0,52 30,52 36,46 56.05,46 56.05,73.75 49.55,73.75 49.55,69 6.61,69 6.61,73.75
LED2_B_R
  Top 0.254: LED1.2 40.84,63.22 R8.1
LED2_G_R
  Top 0.254: LED1.4 42.67,65.81 42.64,65.79 R12.1
LED2_R_R
  Top 0.254: LED1.3 44.37,67.41 43.96,67.82 R10.1
LED_B
  Top 0.254: U2.P.18 36.6,65.84 37.17,65.28 37.17,64.01 37.42,63.75 R8.2
LED_G
  Top 0.254: U2.P.19 36.77,66.94 37.93,65.79 R12.2
LED_R
  Top 0.254: U2.P.20 38.38,68.04 R10.2
LINE_FUSED
  Bottom 1.27: CON_BLIND.2 16.07,5.76 16.14,5.76 18.6,3.3 26.9,3.3 28,4.4 28,5.97 FUSE_MAINS.2 43.41,5.99 U3.AC/L
LINE_UNFUSED
  Bottom 1.27: CON_AC_IN.1 25.51,31.01 FUSE_MAINS.1
LOAD_B
  Top 0.406: R11.2 24.37,44.17 R9.2
  Bottom 0.406: T1.T2 16.84,43.04 18,44.2 18.03,44.17 R11.2
  Bottom 1.27: RELAY1.11 13.35,22.95 16.8,26.4 16.8,32 16.8,36.64 T1.T2
MOC_AN
  Top 0.406: R13.2 OK1.1
  Bottom 0.254: OK1.1 3.09,46.74 R2.1
MOC_OUT
  Top 0.406: OK1.6 17.84,46.74 R1.1
MOTOR_B_GATE_R
  Top 0.254: R4.2 2.51,66.69 R5.1
  Top 0.406: Q2.1 2.7,63.78 R4.2
N$2
  Top 0.406: R1.2 26,46.8 26.7,46.1 R9.1 27.6,44.6 28.1,44.1 C5.1
NEUTRAL
  Bottom 0.406: C6.2 24.07,39.63 24.1,39.6 | C5.2 28.67,39.63 28.7,39.6
  Bottom 1.27: U3.AC/N 33.5,18.26 33.5,31.3 30.49,34.11 CON_AC_IN.2 30.54,37.76 28.7,39.6 24.1,39.6 22.1,39.6 19.38,36.88 T1.T1
RELAY_COIL_DIR
  Top 0.406: R7.2 0.6,53.63 0.6,18.5 2.15,16.95 RELAY1.A2
  Bottom 0.406: RELAY1.A2 4.01,16.95 D8.A
RELAY_COIL_DIR_R
  Top 0.406: R7.1 1.37,57.6 Q2.3
RTC_XTAL1
  Bottom 0.254: 22.4,63.88 Y1.1
  Bottom 0.406: U1.1 22.4,63.88
RTC_XTAL2
  Bottom 0.406: U1.2 20.53,65.15 20.07,64.69 20.07,64.01 | Y1.4 20.07,64.01 | 20.07,64.01 20.41,64.01
SCL  (via drill 0.5 pad 1, 0.5 pad 1.05)
  Top 0.254: 26.5,61.8 26.5,58.17 28.28,56.39 32.6,56.39 34.08,54.91 U2.P.10 | 26.5,61.8 26.5,64.26 27.01,64.77 | v25.3,61.8 26.5,61.8
  Top 0.406: 27.01,64.77 v27.01,64.73
  Bottom 0.254: R17.1 30.86,66.42 U1.6 27.64,66.42 27.01,65.79 v27.01,64.73 | JP1.1 25.07,61.57 v25.3,61.8
SDA  (via drill 0.5 pad 1, 0.5 pad 1.05)
  Top 0.254: U2.P.13 28.81,58.14 27.77,59.18 27.77,64.01 28.02,64.26 28.02,66.55 v27.26,67.31 24,64.05 24,61.4 24,61.2 v25,60.2
  Bottom 0.152: 31.62,67.69 R15.1
  Bottom 0.254: 31.62,67.69 U1.5 27.64,67.69 v27.26,67.31 | JP1.3 15.54,60.2 v25,60.2
SNUB_MID
  Bottom 0.406: C6.1 20.14,42.17 R11.1
SWDCLK  (via drill 0.5 pad 1.05)
  Top 0.254: U2.SWDCLK 36.52,63.64 37.68,62.48 40.98,62.48 41.99,61.47 | 41.99,61.47 J2.4 | v42.76,61.74 42.49,61.47 41.99,61.47
  Bottom 0.254: SWD.2 41.6,60.58 v42.76,61.74
SWDIO  (via drill 0.5 pad 1.05)
  Top 0.254: J2.2 40.73,61.47 40.41,61.78 37.3,61.78 37.1,61.78 | U2.SWDIO 36.54,62.54 36.91,62.17 36.91,61.8 | v36.91,56.64 36.91,61.5 | 36.91,61.5 36.91,61.72 | 36.91,61.72 36.91,61.77 36.91,61.78 37.1,61.78 | 36.91,61.8 36.91,61.67 | 37.1,61.78 36.98,61.78 36.91,61.72 | 36.91,61.5 36.91,61.8
  Bottom 0.254: v36.91,56.64 36.97,56.58 SWD.4
TRIAC_GET
  Bottom 1.27: OK1.4 14.11,36.87 T1.G
U4_BYPASS
  Top 0.406: U4.4 39.86,52.6 C18.1
VBAT
  Bottom 0.406: JP3.1 13.66,66.42 U1.3